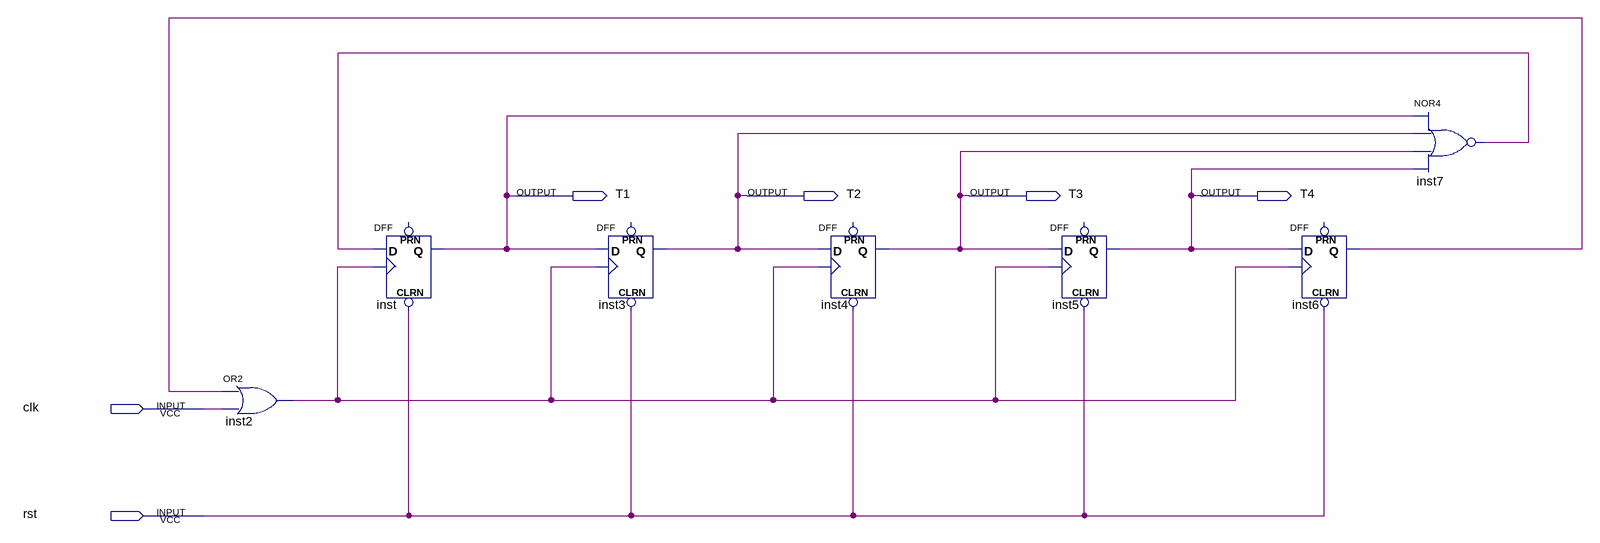
[diagram p0: schematic sheet]
// Quartus schematic 11improve.bdf as structural Verilog: 7 symbols, 6 pins
module \11improve  (
  input  clk,
  input  rst,
  output T1,
  output T2,
  output T3,
  output T4
);

  wire inst2_out, inst6_q, inst7_out;

  or inst2 (inst2_out, inst6_q, clk);
  DFF inst (.CLRN(rst), .CLK(inst2_out), .D(inst7_out), .Q(T1));  // open: PRN
  DFF inst3 (.CLRN(rst), .CLK(inst2_out), .D(T1), .Q(T2));  // open: PRN
  DFF inst4 (.CLRN(rst), .CLK(inst2_out), .D(T2), .Q(T3));  // open: PRN
  DFF inst5 (.CLRN(rst), .CLK(inst2_out), .D(T3), .Q(T4));  // open: PRN
  DFF inst6 (.CLRN(rst), .CLK(inst2_out), .D(T4), .Q(inst6_q));  // open: PRN
  nor inst7 (inst7_out, T1, T2, T3, T4);
endmodule
